# Altium schematic sheet Motherboard.SchDoc
size A3
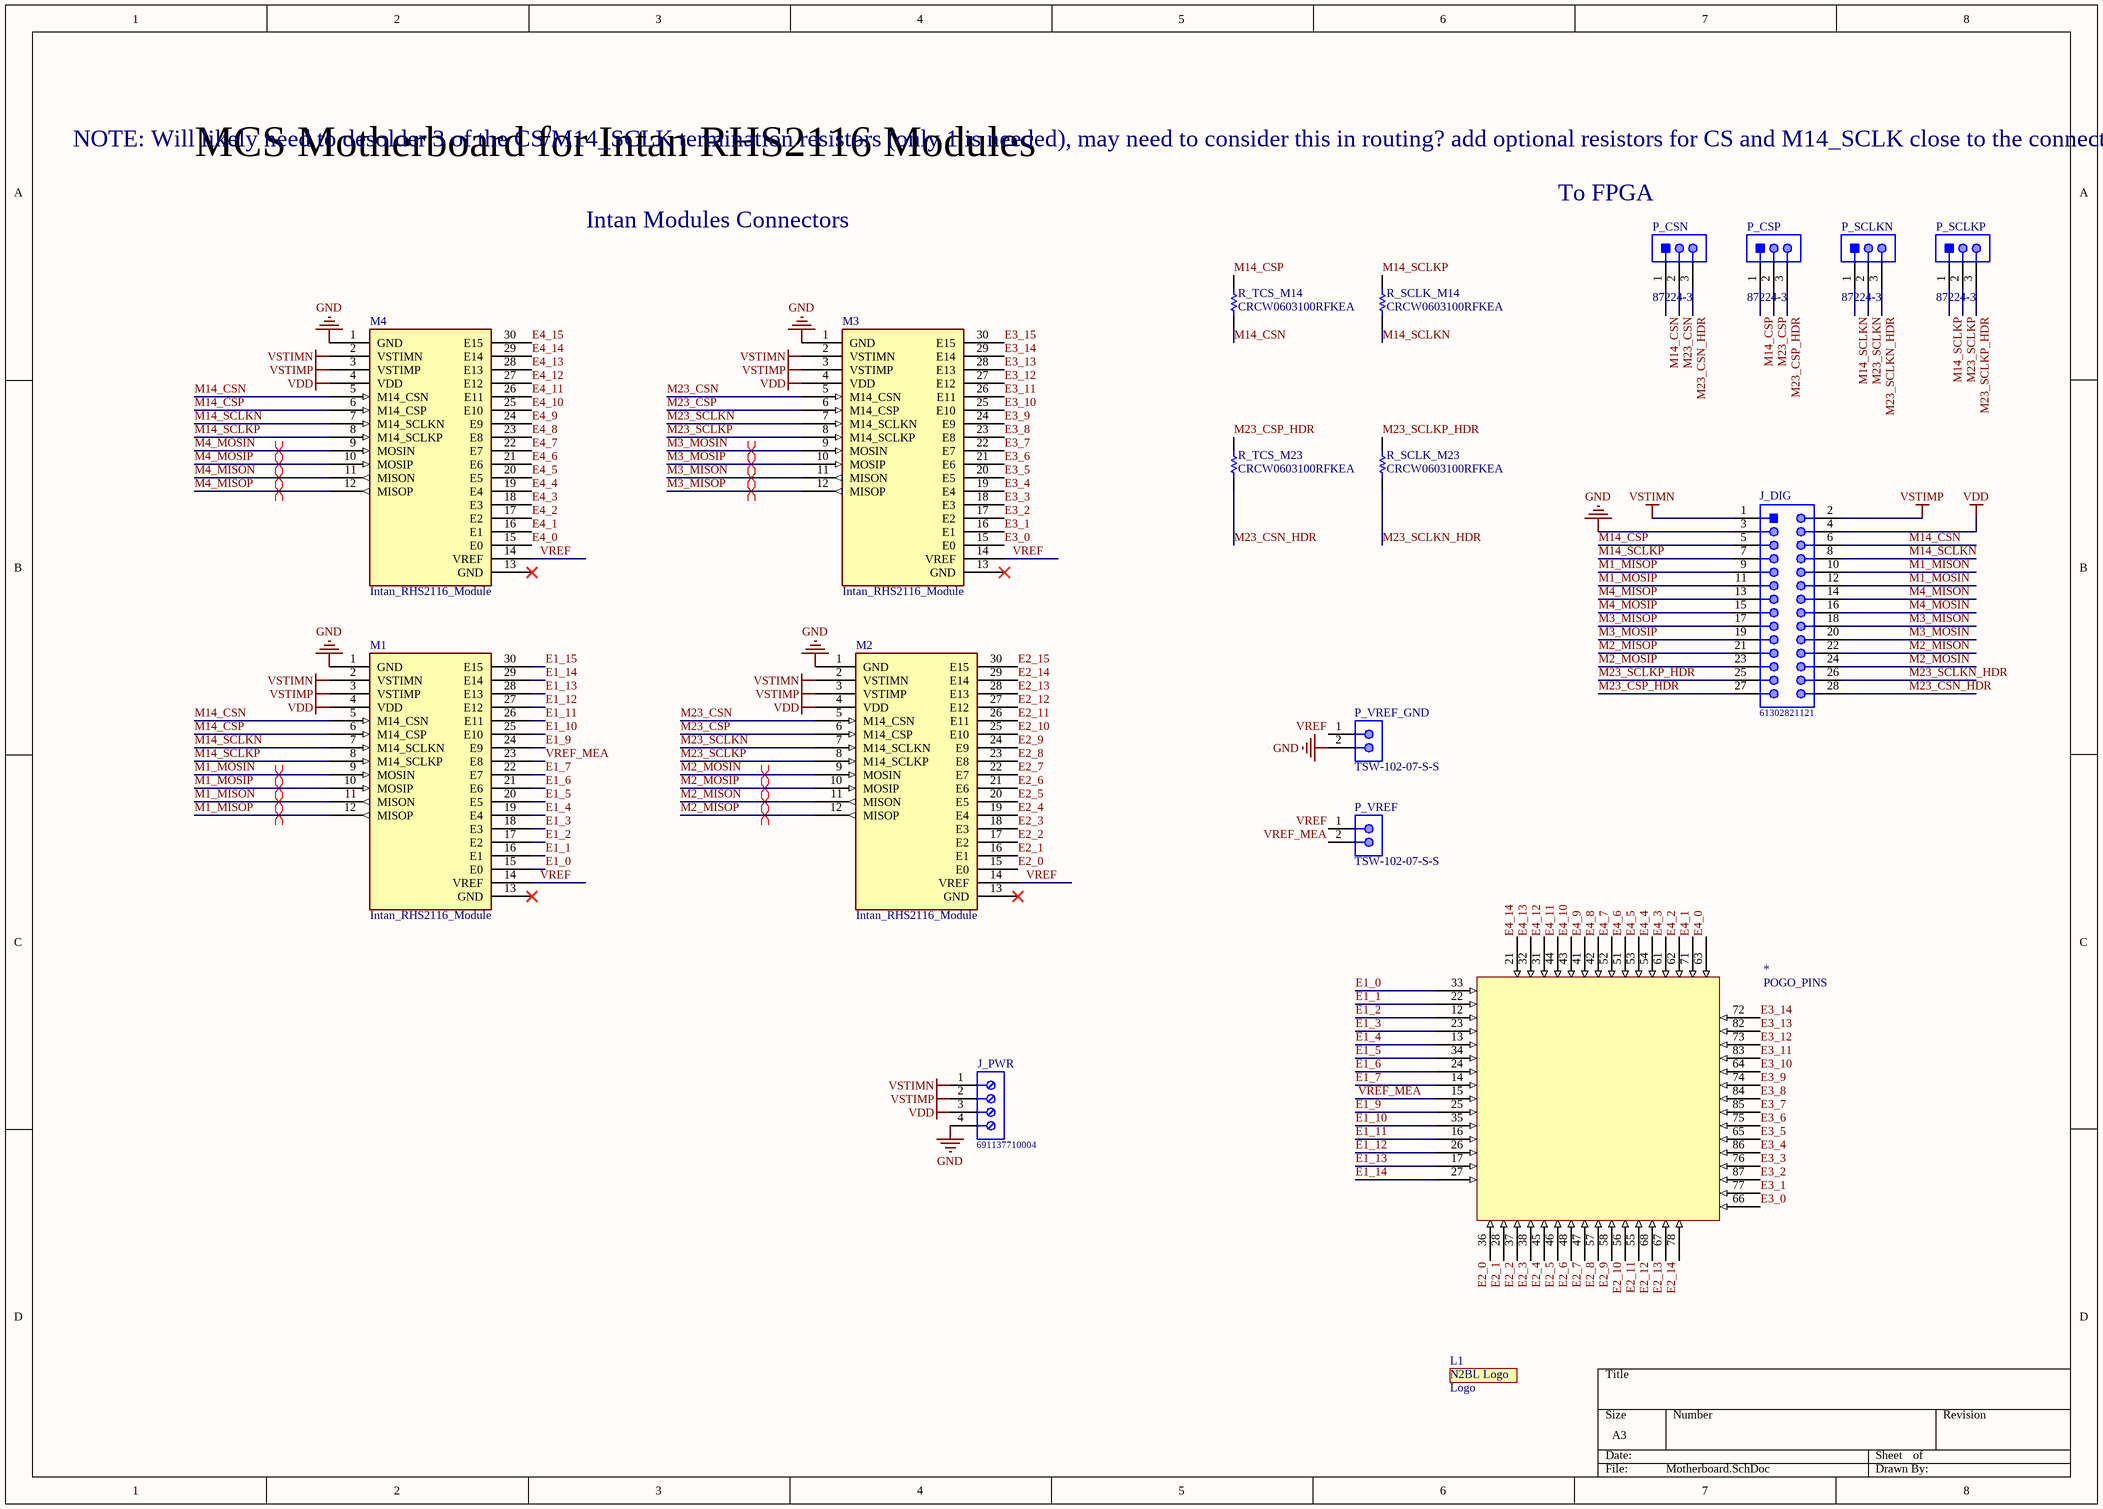
[diagram p0: Motherboard.SchDoc]

## Parts
*  POGO_PINS  [POGO_PINS]
J_DIG  61302821121  [61302821121]
J_PWR  691137710004  [691137710004]
L1  Logo  [N2BL_Logo]
M1  Intan_RHS2116_Module  [Intan_RHS2116_Module]
M2  Intan_RHS2116_Module  [Intan_RHS2116_Module]
M3  Intan_RHS2116_Module  [Intan_RHS2116_Module]
M4  Intan_RHS2116_Module  [Intan_RHS2116_Module]
P_CSN  87224-3  [TECO-87224-3_V]
P_CSP  87224-3  [TECO-87224-3_V]
P_SCLKN  87224-3  [TECO-87224-3_V]
P_SCLKP  87224-3  [TECO-87224-3_V]
P_VREF  TSW-102-07-S-S  [SMTC-TSW-102-07-S-S]
P_VREF_GND  TSW-102-07-S-S  [SMTC-TSW-102-07-S-S]
R_SCLK_M14  CRCW0603100RFKEA  [RESC1609X50X30ML8T20]
R_SCLK_M23  CRCW0603100RFKEA  [RESC1609X50X30ML8T20]
R_TCS_M14  CRCW0603100RFKEA  [RESC1609X50X30ML8T20]
R_TCS_M23  CRCW0603100RFKEA  [RESC1609X50X30ML8T20]

## Nets
GND: J_DIG.3 J_PWR.4 M1.1(GND) M2.1(GND) M3.1(GND) M4.1(GND) P_VREF_GND.2
VDD: J_DIG.4 J_PWR.3 M1.4(VDD) M2.4(VDD) M3.4(VDD) M4.4(VDD)
VSTIMN: J_DIG.1 J_PWR.1 M1.2(VSTIMN) M2.2(VSTIMN) M3.2(VSTIMN) M4.2(VSTIMN)
VSTIMP: J_DIG.2 J_PWR.2 M1.3(VSTIMP) M2.3(VSTIMP) M3.3(VSTIMP) M4.3(VSTIMP)
E1_0: *.33 M1.15(E0)
E1_1: *.22 M1.16(E1)
E1_2: *.12 M1.17(E2)
E1_3: *.23 M1.18(E3)
E1_4: *.13 M1.19(E4)
E1_5: *.34 M1.20(E5)
E1_6: *.24 M1.21(E6)
E1_7: *.14 M1.22(E7)
E1_9: *.25 M1.24(E9)
E1_10: *.35 M1.25(E10)
E1_11: *.16 M1.26(E11)
E1_12: *.26 M1.27(E12)
E1_13: *.17 M1.28(E13)
E1_14: *.27 M1.29(E14)
E1_15: M1.30(E15)
E2_0: *.36 M2.15(E0)
E2_1: *.28 M2.16(E1)
E2_2: *.37 M2.17(E2)
E2_3: *.38 M2.18(E3)
E2_4: *.45 M2.19(E4)
E2_5: *.46 M2.20(E5)
E2_6: *.48 M2.21(E6)
E2_7: *.47 M2.22(E7)
E2_8: *.57 M2.23(E8)
E2_9: *.58 M2.24(E9)
E2_10: *.56 M2.25(E10)
E2_11: *.55 M2.26(E11)
E2_12: *.68 M2.27(E12)
E2_13: *.67 M2.28(E13)
E2_14: *.78 M2.29(E14)
E2_15: M2.30(E15)
E3_0: *.66 M3.15(E0)
E3_1: *.77 M3.16(E1)
E3_2: *.87 M3.17(E2)
E3_3: *.76 M3.18(E3)
E3_4: *.86 M3.19(E4)
E3_5: *.65 M3.20(E5)
E3_6: *.75 M3.21(E6)
E3_7: *.85 M3.22(E7)
E3_8: *.84 M3.23(E8)
E3_9: *.74 M3.24(E9)
E3_10: *.64 M3.25(E10)
E3_11: *.83 M3.26(E11)
E3_12: *.73 M3.27(E12)
E3_13: *.82 M3.28(E13)
E3_14: *.72 M3.29(E14)
E3_15: M3.30(E15)
E4_0: *.63 M4.15(E0)
E4_1: *.71 M4.16(E1)
E4_2: *.62 M4.17(E2)
E4_3: *.61 M4.18(E3)
E4_4: *.54 M4.19(E4)
E4_5: *.53 M4.20(E5)
E4_6: *.51 M4.21(E6)
E4_7: *.52 M4.22(E7)
E4_8: *.42 M4.23(E8)
E4_9: *.41 M4.24(E9)
E4_10: *.43 M4.25(E10)
E4_11: *.44 M4.26(E11)
E4_12: *.31 M4.27(E12)
E4_13: *.32 M4.28(E13)
E4_14: *.21 M4.29(E14)
E4_15: M4.30(E15)
M1_MISON: J_DIG.10 M1.11(MISON)
M1_MISOP: J_DIG.9 M1.12(MISOP)
M1_MOSIN: J_DIG.12 M1.9(MOSIN)
M1_MOSIP: J_DIG.11 M1.10(MOSIP)
M2_MISON: J_DIG.22 M2.11(MISON)
M2_MISOP: J_DIG.21 M2.12(MISOP)
M2_MOSIN: J_DIG.24 M2.9(MOSIN)
M2_MOSIP: J_DIG.23 M2.10(MOSIP)
M3_MISON: J_DIG.18 M3.11(MISON)
M3_MISOP: J_DIG.17 M3.12(MISOP)
M3_MOSIN: J_DIG.20 M3.9(MOSIN)
M3_MOSIP: J_DIG.19 M3.10(MOSIP)
M4_MISON: J_DIG.14 M4.11(MISON)
M4_MISOP: J_DIG.13 M4.12(MISOP)
M4_MOSIN: J_DIG.16 M4.9(MOSIN)
M4_MOSIP: J_DIG.15 M4.10(MOSIP)
M14_CSN: J_DIG.6 M1.5(M14_CSN) M4.5(M14_CSN) P_CSN.1 R_TCS_M14.1
M14_CSP: J_DIG.5 M1.6(M14_CSP) M4.6(M14_CSP) P_CSP.1 R_TCS_M14.2
M14_SCLKN: J_DIG.8 M1.7(M14_SCLKN) M4.7(M14_SCLKN) P_SCLKN.1 R_SCLK_M14.1
M14_SCLKP: J_DIG.7 M1.8(M14_SCLKP) M4.8(M14_SCLKP) P_SCLKP.1 R_SCLK_M14.2
M23_CSN: M2.5(M14_CSN) M3.5(M14_CSN) P_CSN.2
M23_CSN_HDR: J_DIG.28 P_CSN.3 R_TCS_M23.1
M23_CSP: M2.6(M14_CSP) M3.6(M14_CSP) P_CSP.2
M23_CSP_HDR: J_DIG.27 P_CSP.3 R_TCS_M23.2
M23_SCLKN: M2.7(M14_SCLKN) M3.7(M14_SCLKN) P_SCLKN.2
M23_SCLKN_HDR: J_DIG.26 P_SCLKN.3 R_SCLK_M23.1
M23_SCLKP: M2.8(M14_SCLKP) M3.8(M14_SCLKP) P_SCLKP.2
M23_SCLKP_HDR: J_DIG.25 P_SCLKP.3 R_SCLK_M23.2
VREF: M1.14(VREF) M2.14(VREF) M3.14(VREF) M4.14(VREF) P_VREF.1 P_VREF_GND.1
VREF_MEA: *.15 M1.23(E8) P_VREF.2

Not connected (* = marked no-connect by the designer): M1 13(GND)*; M2 13(GND)*; M3 13(GND)*; M4 13(GND)*

## Layout directives
differential pair: M1_MISON, M1_MISOP, M1_MOSIN, M1_MOSIP, M2_MISON, M2_MISOP, M2_MOSIN, M2_MOSIP, M3_MISON, M3_MISOP, M3_MOSIN, M3_MOSIP, M4_MISON, M4_MISOP, M4_MOSIN, M4_MOSIP

## Notes on the sheet
- NOTE: Will likely need to desolder 3 of the CS/M14_SCLK termination resistors (only 1 is needed), may need to consider this in routing? add optional resistors for CS and M14_SCLK close to the connector?
- MCS Motherboard for Intan RHS2116 Modules
- Intan Modules Connectors
- To FPGA
- (in symbol Neuron To Brain Lab Logo) N2BL Logo

## Library data of the parts
J_DIG = CMP-1502-01115-1: THT Vertical Pin Header WR-PHD, Pitch 2.54 mm, Dual Row, 28 pins; Manufacturer: Wurth Elektronik; Pin Number: 28; Contact Resistance: 20mOhm; Withstanding Voltage: 500VAC; Pitch: 2.54mm; Gender: Male; Working Voltage: 250VAC; Rated Current: 3A; Package Reference: 61302821121; Part Number: 61302821121; Mounting Technology: THT; Packaging: Bag; Manufacturer URL: http://www.we-online.de; Row Number: Dual; Orientation: Vertical; Operating Temperature: -40to105degC; Datasheet URL: https://katalog.we-online.de/em/datasheet/6130xx21121.pdf; Publisher: WurthElektronik
J_PWR = CMP-1502-03326-1: Series 1377 - 5.00 mm Horizontal Entry with Pressure Clamp WR-TBL, 4 pin; Manufacturer: Wurth Elektronik; Pin Number: 4; Pitch: 5.00mm; Package Reference: 691137710004; Publisher: WurthElektronik; Mounting Technology: THT; Manufacturer URL: http://www.we-online.de; Operating Temperature: -30to120degC; Packaging: Box; Datasheet URL: http://katalog.we-online.de/pbs/datasheet/691137710004.pdf; Part Number: 691137710004
L1 = Neuron To Brain Lab Logo
P_CSN P_CSP P_SCLKN P_SCLKP = CMP-2000-05697-1: Male Header, Pitch 2.54 mm, 1 x 3 Position, Height 10.744 mm, Tail Length 3.175 mm, -65 to 105 degC, RoHS, Bulk; Manufacturer: TE Connectivity; Catalog Drawings: SingleSquareStraightPost / SingleSquareStraightPostSide; Connector Type: Header,Unshrouded; Pitch: 0.100"(2.54mm); Mating Products: 147738-2-ND / -CONNRCPT3POSVERTSMDGOLD / 147723-2-ND / -CONNRCPT3POSVERT.100GOLD / 146763-5-ND / -CONNRCPT3POSSGLVERT.100T/H / A32904-ND / -CONNRECEPT3POS.100VERTGOLD / A26922-ND / -CONNHOUSING3POS.100LOCKING / A26415-ND / -CONNRECEPT3POS.100VERTAU / A26964-ND / -CONNHOUSING3POS.100SINGLE / A3012-ND / -CONNHOUSING3POS.100SINGLE; Number of Positions Loaded: All; Featured Product: AMPMODUConnectors; Dynamic Catalog: AMPMODUModIISeries; 3D Model: 87224-3.pdf; Other Names: 87224-3-ND / A26545; Number of Positions: 3; RoHS Information: 87224-3StatementofCompliance; Termination: Solder; Datasheet URL: http://www.te.com/commerce/DocumentDelivery/DDEController?Action=showdoc&DocId=Customer+Drawing%7F87224%7FL3%7Fpdf%7FEnglish%7FENG_CD_87224_L3.pdf%7F87224-3; Category: Connectors,Interconnects; Contact Mating Length: 0.318"(8.08mm); Standard Package: 520; Mounting Type: ThroughHole; Family: RectangularConnectors-Headers,MalePins; Number of Rows: 1; Series: AMPMODUModII; Contact Finish Thickness: 15µin(0.38µm); Datasheet Version: Rev. L3, 08/2015; Package Reference: 87224-3; Mounting Technology: ThroughHole; Manufacturer URL: http://www.te.com/; Contact Type: MalePin; Packaging: Bulk; Color: Black; Package Description: Male Header, Pitch 2.54 mm, 1 x 3 Position, Height 10.744 mm, Tail Length 3.175 mm; Contact Finish: Gold
P_VREF P_VREF_GND = CMP-1681-00004-4: Male Header, Pitch 2.54 mm, 1 x 2 Position, Height 8.38 mm, Tail Length 2.54 mm, -55 to 125 degC, RoHS, Bulk; Manufacturer: Samtec; Rows: 1; ComponentLink1URL: http://www.samtec.com/; Contact Finish: Gold; Mounting Technology: Through Hole; PackageReference: TSW-102-07-S-S; RoHSCompliant: true; Pins: 2; Contact Material: Bronze; ComponentLink2Description: Datasheet; Max Operating Temperature: 125 degC; Min Operating Temperature: -55 degC; Height: 8.38 mm; Packaging: Bulk; ComponentLink1Description: Manufacturer URL; PackageDescription: Male Header, Pitch 2.54 mm, 1 x 2 Position, Height 8.38 mm, Tail Length 2.54 mm; Colour: Black; Contact Plating: Gold; Length: 5.08 mm; ComponentLink2URL: http://suddendocs.samtec.com/catalog_english/tsw_th.pdf; DatasheetVersion: 12/2015; Mount: Through Hole; Lead Pitch: 0.1 inch; REACH SVHC: No SVHC; Package Quantity: 1
R_SCLK_M14 R_SCLK_M23 R_TCS_M14 R_TCS_M23 = CMP-1666-00008-4: Chip Resistor, 100 Ohm, +/- 1%, 100 mW,-55 to 155 degC, 0603 (1608 Metric), RoHS, Tape and Ree; Manufacturer: Vishay Semiconductor; ComponentLink2URL: http://www.vishay.com/docs/20035/dcrcwe3.pdf; ComponentLink1URL: http://www.vishay.com/; Mounting Technology: Surface Mount; ComponentLink1Description: Manufacturer URL; ComponentLink2Description: Datasheet; PackageDescription: 2-Pin Surface Mount Device, Body 1.575 x 0.85 mm; PackageReference: 0603; DatasheetVersion: 06/2012